# Altium schematic sheet Metal sensor.SchDoc
size A4
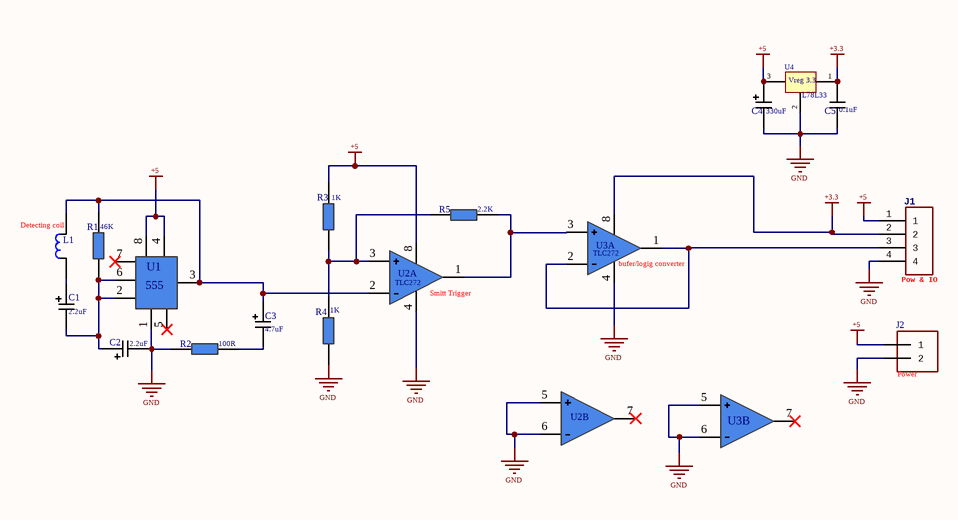
[diagram p0: Metal sensor.SchDoc]

## Parts
C1  2.2uF  [cap elect]
C2  2.2uF  [cap elect]
C3  4.7uF  [cap elect]
C4  330uF  [cap elect]
C5  0.1uF  [cap ceram]
J1  Pow & IO  [1X04-3.5MM]
J2  Power  [1X2-3.5MM]
L1  coil  [1X2-3.5MM]  (value not drawn)
R1  46K  [Resistor]
R2  100R  [Resistor]
R3  1K  [Resistor]
R4  1K  [Resistor]
R5  2.2K  [Resistor]
U1  555  [DIP8]
U2  TLC272  [DIP8]  (parts A,B of 2)
U3  TLC272  [DIP8]  (parts A,B of 2)
U4  L78L33  [TO92-INLINE]

## Nets
+3.3: C5.2 J1.2 U3.8(Vdd) U4.1(out8)
+5: C4.2 J1.1 J2.1 R3.2 U1.4(gnd) U1.8(gnd) U2.8(Vdd) U4.3(in)
GND: C2.1 C4.1 C5.1 J1.4 J2.2 R2.1 R4.1 U1.1(gnd) U2.4(gnd) U2.5(1in+) U2.6(1in-) U3.4(gnd) U3.5(1in+) U3.6(1in-) U4.2(gnd)
NetC1_1: C1.1 C2.2 R1.1 U1.2(gnd) U1.6(gnd)
NetC1_2: C1.2 L1.1
NetC3_1: C3.1 R2.2
NetC3_2: C3.2 L1.2 R1.2 U1.3(gnd) U2.2(1in-)
NetJ1_3: J1.3 U3.1(out) U3.2(1in-)
NetR3_1: R3.1 R4.2 R5.1 U2.3(1in+)
NetR5_2: R5.2 U2.1(out) U3.3(1in+)

Not connected (* = marked no-connect by the designer): U1 5(gnd)* 7(gnd)*; U2 7(out)*; U3 7(out)*

## Notes on the sheet
- (near L1) Detecting coil
- (near U3) bufer/logig converter
- (near U2) Smitt Trigger
- (in symbol Regulator) Vreg 3.3

## Library data of the parts
C1-C4 = capacitor_electrolitic
C5 = capacitor_ceramic
J1 = 1X4-3.5MM
J2 = 1X2-3.5MM
R1-R5 = resistor
U1 = 555timer
U2 U3 = op-amp
U4 = Regulator